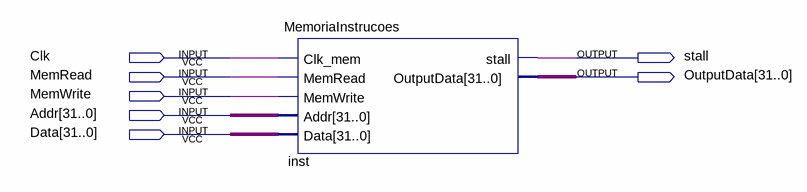
[diagram p0: schematic sheet]
// Quartus schematic TesteInstructionMemory.bdf as structural Verilog: 1 symbols, 7 pins
module TesteInstructionMemory (
  input  Clk,
  input  MemRead,
  input  MemWrite,
  input  [31:0] Addr,
  input  [31:0] Data,
  output stall,
  output [31:0] OutputData
);

  MemoriaInstrucoes inst (
    .Clk_mem(Clk), .MemRead(MemRead), .MemWrite(MemWrite), .Addr(Addr), .Data(Data), .stall(stall),
    .OutputData(OutputData));
endmodule
